# Altium project Optical Compressor.PrjPcb (part 1 of 2)
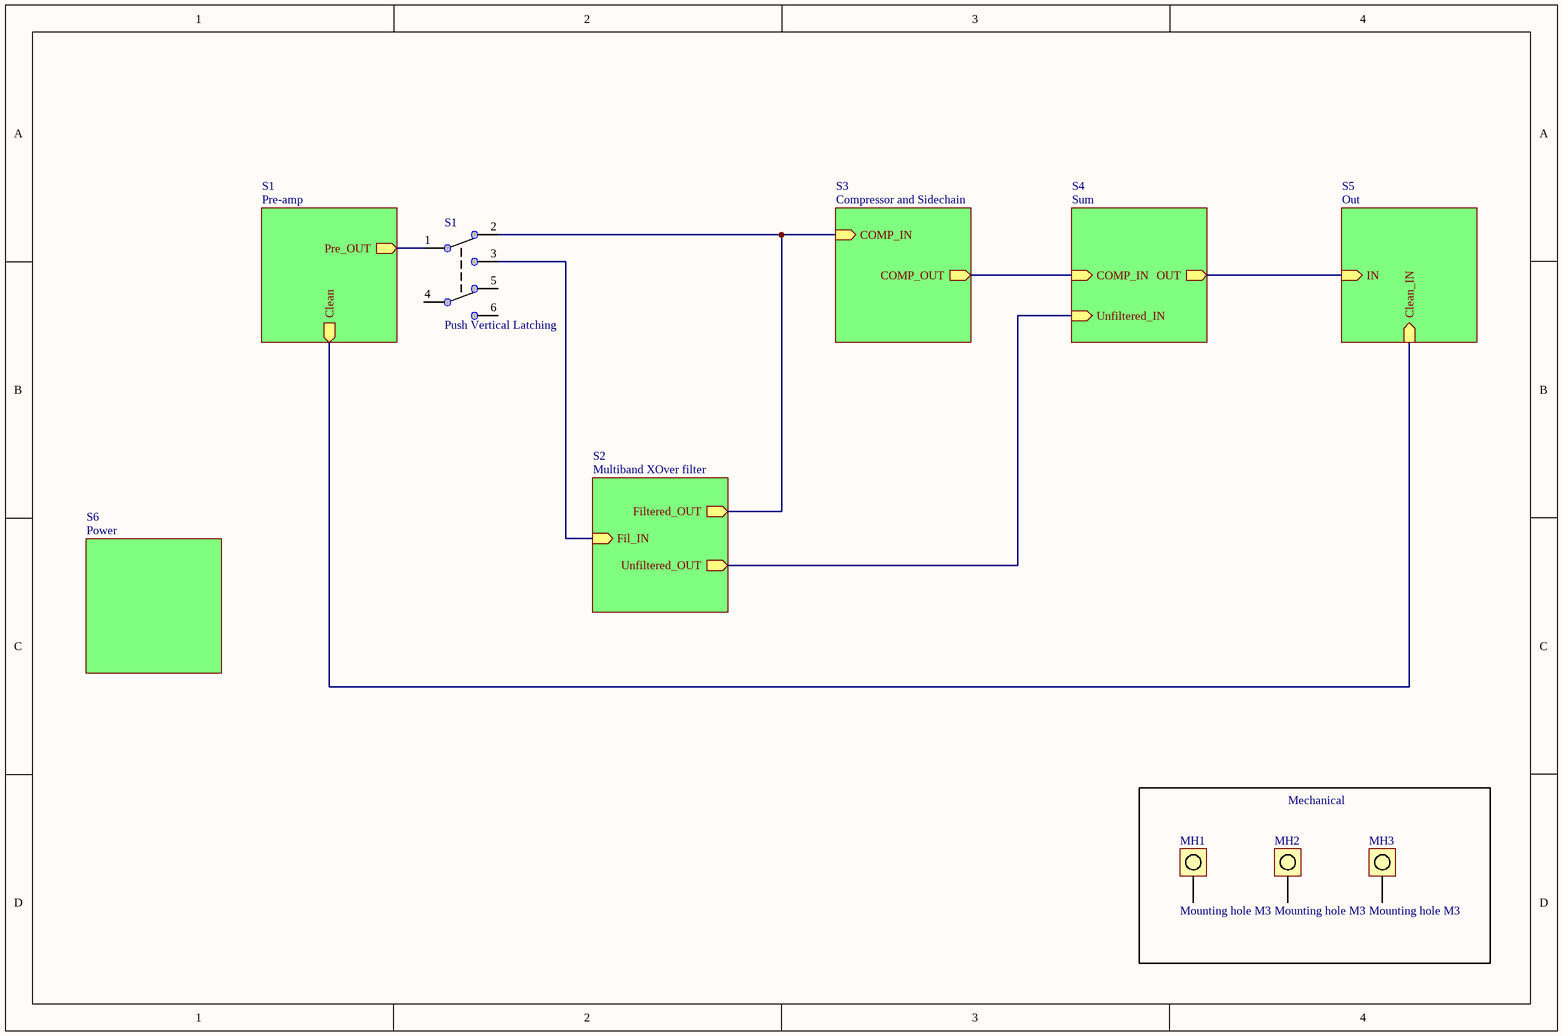
[diagram p0: Main.SchDoc]
7 sheets, 118 parts. Net scope: hierarchical (ports join the sheet entries above them; power ports are global).
Board file: Optical Compresor_V1.PcbDoc
Sheets:
  Main.SchDoc
    S1 = Pre-amp.SchDoc
    S3 = Compressor and Sidechain.SchDoc
    S5 = Out.SchDoc
    S6 = Power.SchDoc
    S2 = Multiband XOver filter.SchDoc
    S4 = Sum.SchDoc

## Sheet Main.SchDoc
size A4; SheetNumber: 1; SheetTotal: 7; ENG_APP_DATE: --/--/--; DSN_APP_DATE: --/--/--; CHK_APP_DATE: --/--/--

### Parts
MH1  Mounting hole M3  [Mounting hole M3]  (no BOM)
MH2  Mounting hole M3  [Mounting hole M3]  (no BOM)
MH3  Mounting hole M3  [Mounting hole M3]  (no BOM)
S1  Push Vertical Latching  [PUSH VERTICAL DPDT]

### Blocks framed on the sheet
Mechanical: MH1-MH3

### Sub-sheets
S1 = Pre-amp: Pre_OUT (out), Clean (out)
S2 = Multiband XOver filter: Fil_IN (in), Filtered_OUT (out), Unfiltered_OUT (out)
S3 = Compressor and Sidechain: COMP_IN (in), COMP_OUT (out)
S4 = Sum: Unfiltered_IN (in), COMP_IN (in), OUT (out)
S5 = Out: IN (in), Clean_IN (in)
S6 = Power: no entries

### Nets
NetC3_2: S1.1 ; sheet S1/Pre_OUT
NetC11_2: sheet S3/COMP_OUT, sheet S4/COMP_IN
NetC32_1: sheet S2/Unfiltered_OUT, sheet S4/Unfiltered_IN
NetR17_1: S1.3 ; sheet S2/Fil_IN
NetR24_2: sheet S5/IN, sheet S4/OUT
NetS1_2: S1.2 ; sheet S3/COMP_IN, sheet S2/Filtered_OUT
NetS2_1: sheet S1/Clean, sheet S5/Clean_IN

Not connected (* = marked no-connect by the designer): MH1 1; MH2 1; MH3 1; S1 4 5 6

### Notes on the sheet
- Document:
- Size:
- Modified date:
- A4
- Number:
- Revision:
- Sheet
- of
- Project:

### Library data of the parts
MH1-MH3 = CMP-021-0014-4: 3.2 mm mounting hole for M3 screw; Design Item ID: Mounting hole M3; Source: jimi.SchLib
S1 = CMP-028-0063-7: DPDT Pushbutton Latching; Manufacturer Part Number: TL2201EEXA; Darkglass part: D00-0005; Manufacturer: E-Switch; Electrical Life: 10000Cycles; Voltage Rating (DC): 30V; Supplied by Darkglass: YES; Actuator Length: 3mm; Operating Force: 2.16N; Current Rating: 100mA; Switch Function: On-On; ComponentLink2URL: https://datasheet.ciiva.com/16156/p010350f-16156301.pdf?src-supplier=Onlinecomponents.com; Termination: PC Pin; Design Item ID: Push Vertical; Source: main.SchLib; Max Voltage Rating (DC): 30V; RoHS: Yes; Orientation: Straight; Stock 1: 351; ComponentLink1URL: https://datasheet.ciiva.com/2879/p010350g-2879559.pdf?src-supplier=Digi-Key; Throw Configuration: DPDT; Lead Free: Lead Free; ComponentLink1Description: https://datasheet.ciiva.com/2879/p010350g-2879559.pdf?src-supplier=Digi-Key; Package Quantity: 700; ComponentLink2Description: https://datasheet.ciiva.com/16156/p010350f-16156301.pdf?src-supplier=Onlinecomponents.com; Contact Material: Silver; Selective Soldering: YES; Packaging: Bulk; Mount: Through Hole; Pricing 1: 1=0,70000, 10=0,66300, 25=0,63400, 50=0,60400, 100=0,58900, 250=0,57400, 500=0,54500, 1000=0,51500, 2500=0,49200, 10000=0,49200 (USD)

## Sheet Pre-amp.SchDoc
size A4; SheetNumber: 2; SheetTotal: 7; ENG_APP_DATE: --/--/--; DSN_APP_DATE: --/--/--; CHK_APP_DATE: --/--/--
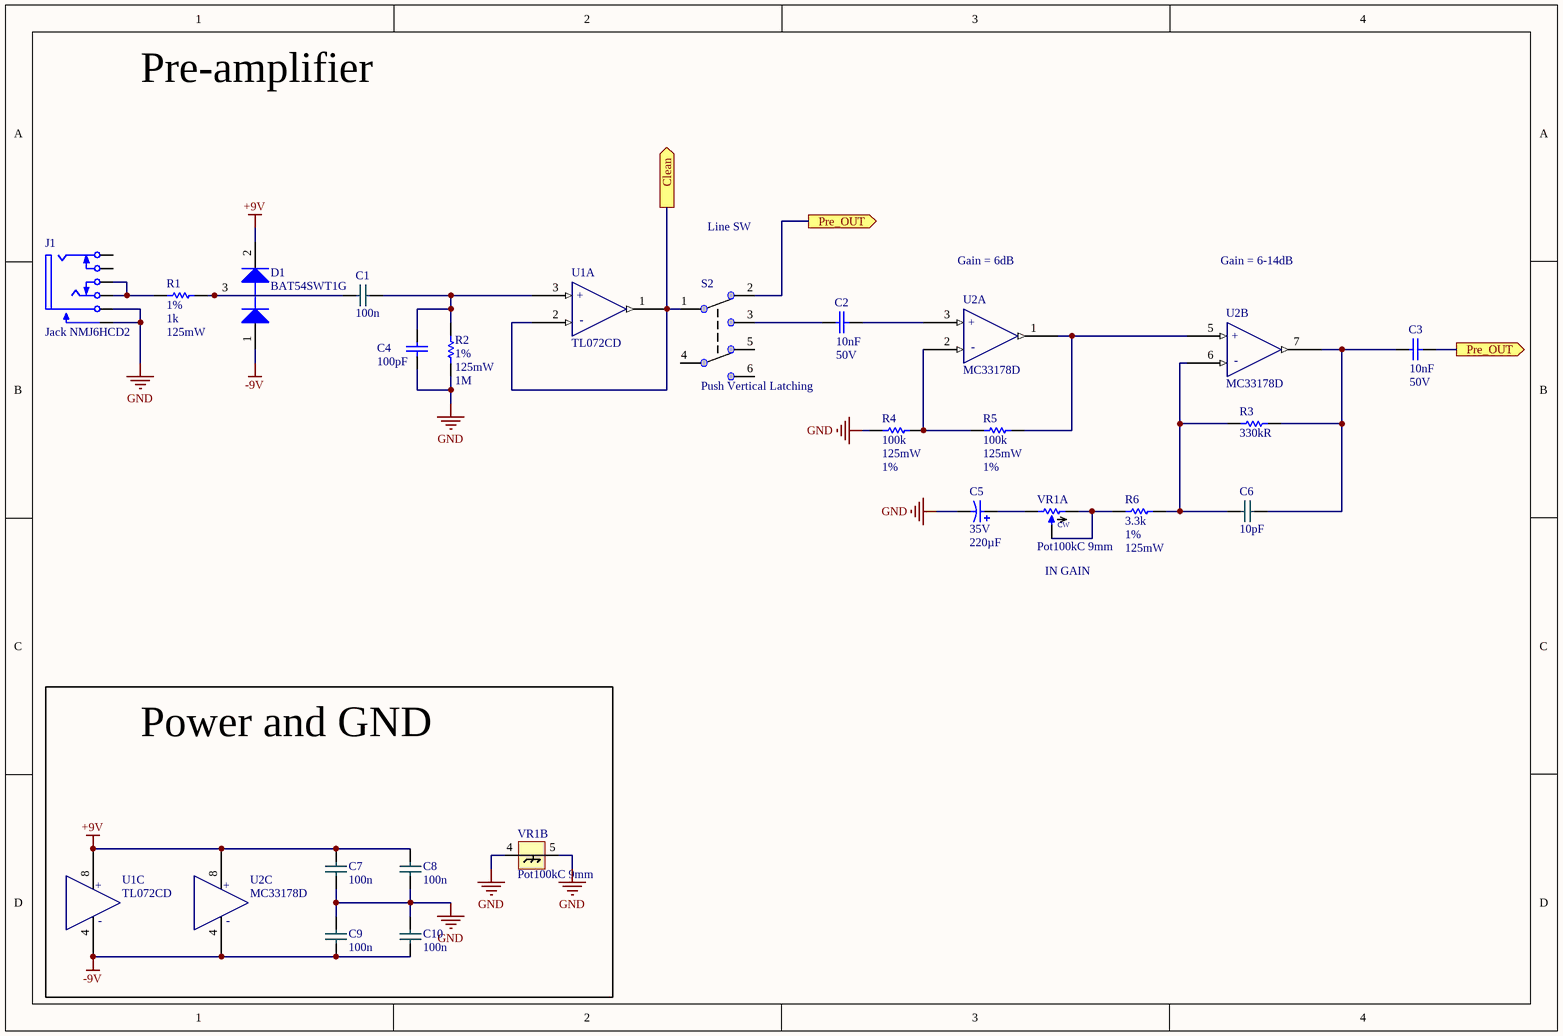
[diagram p1: Pre-amp.SchDoc]

### Parts
C1  value 100n  [0805-CAP]  (hidden comment: Cap 0805 100nF 4)
C2  Capacitance: 10nF  Rated Voltage: 50V  [0805-CAP]  (hidden comment: Cap 10nF 0805 C0G)
C3  Capacitance: 10nF  Rated Voltage: 50V  [0805-CAP]  (hidden comment: Cap 10nF 0805 C0G)
C4  Capacitance: 100pF  [0603-CAP]  (hidden comment: Cap 100pF 0603 C0G)
C5  Rated Voltage: 35V  Capacitance: 220µF  [E-CAP, SMT, diameter 10mm, height 10.2mm]  (hidden comment: Cap pol 220µF 35V)
C6  Capacitance: 10pF  [0805-CAP]  (hidden comment: cap 0805 10pF)
C7  value 100n  [0805-CAP]  (hidden comment: Cap 0805 100nF 4)
C8  value 100n  [0805-CAP]  (hidden comment: Cap 0805 100nF 4)
C9  value 100n  [0805-CAP]  (hidden comment: Cap 0805 100nF 4)
C10  value 100n  [0805-CAP]  (hidden comment: Cap 0805 100nF 4)
D1  BAT54SWT1G  [ONSC-SOT-323-3-419-04_V]
J1  Jack NMJ6HCD2  [Neutrik Jack metal nut]
R1  Tolerance (+-): 1%  Resistance: 1k  Power: 125mW  [0805-RES]  (hidden comment: Res 1k 1% 0805)
R2  Tolerance (+-): 1%  Power: 125mW  Resistance: 1M  [0805-RES]  (hidden comment: Res 1M 1% 0805)
R3  Resistance: 330kR  [0805-RES]  (hidden comment: Res 0805 330k 1%)
R4  Resistance: 100k  Power: 125mW  Tolerance (+-): 1%  [0805-RES]  (hidden comment: Res 100k 1% 0805)
R5  Resistance: 100k  Power: 125mW  Tolerance (+-): 1%  [0805-RES]  (hidden comment: Res 100k 1% 0805)
R6  Resistance: 3.3k  Tolerance (+-): 1%  Power: 125mW  [0805-RES]  (hidden comment: Res 3.3k 1% 0805)
S2  Push Vertical Latching  [PUSH VERTICAL DPDT]
U1  TL072CD  [SOIC8-127P600X175-8N]  (parts A,C of 3)
U2  MC33178D  [SOIC8-127P600X175-8N]  (parts A,B,C of 3)
VR1  Pot100kC 9mm  [LJV 9mm pot]  (parts A,B of 2)

### Blocks framed on the sheet
Power and GND: C7-C10 U1 U2 VR1

### Ports
Clean (out), Pre_OUT (out)

### Nets
+9V: C7.2 C8.2 D1.2(K) U1.8(V+) U2.8
-9V: C9.1 C10.1 D1.1(A) U1.4(V-) U2.4
GND: C4.2 C5.2 C7.1 C8.1 C9.2 C10.2 J1.1 J1.6 R2.2 R4.1 VR1.4 VR1.5
NetC1_1: C1.1 D1.3(K/A) R1.2
NetC1_2: C1.2 C4.1 R2.1 U1.3(IN+)
NetC2_1: C2.1 S2.3
NetC2_2: C2.2 U2.3
NetC3_1: C3.1 C6.2 R3.2 U2.7
NetC3_2: C3.2 S2.2 ; port Pre_OUT
NetC5_1: C5.1 VR1.1(CCWPIN)
NetC6_1: C6.1 R3.1 R6.2 U2.6
NetJ1_3: J1.3 J1.4 R1.1
NetR4_2: R4.2 R5.1 U2.2
NetR5_2: R5.2 U2.1 U2.5
NetR6_1: R6.1 VR1.2(WIPER) VR1.3(CWPIN)
NetS2_1: S2.1 U1.1(OUT) U1.2(IN-) ; port Clean

Not connected (* = marked no-connect by the designer): J1 2 5; S2 4 5 6

### Notes on the sheet
- Pre-amplifier
- Line SW
- Gain = 6dB
- Gain = 6-14dB
- (near VR1) IN GAIN
- Document:
- Size:
- Modified date:
- A4
- Number:
- Revision:
- Sheet
- of
- Project:
- (in symbol CMP-028-0012-7, part A) +; -
- (in symbol CMP-028-0012-7, part C) +; -
- (in symbol CMP-028-0053-5, part A) CW
- (in symbol CMP-032-0003-7, part A) +; -
- (in symbol CMP-032-0003-7, part B) +; -
- (in symbol CMP-032-0003-7, part C) +; -

### Library data of the parts
C1 C7-C10 = CMP-019-0144-11: 0.1uF 25volts C0G 5%; Source: main.SchLib; PackageDescription: Chip Capacitor; LatestRevisionNote: IPC-7351 Footprint Added.; LatestRevisionDate: 29-May-2009; Publisher: Altium Limited; Published: 8-Jun-2000; Mouser part: 81-GRM31C5C1E104JA01; Design Item ID: Cap 0805 100nF 4; PackageReference: C1206; Fitted: Fitted
C2 C3 = CMP-04096-2: Cap 10nF 0805 C0G 50V +-5%; Tolerance (+-): 5%; Dielectric: C0G; Maximum operating temperature: 125°C; Height: 950µm; Size (Imperial): 0805
C4 = CMP-04086-2: Cap 100pF 0603 C0G 50V +-5%; Tolerance (+-): 5%; Rated Voltage: 50V; Maximum operating temperature: 125°C; Height: 900µm; Size (Imperial): 0603; Dielectric: C0G
C5 = CMP-00120-4: Cap Aluminum 220uF 35V ±20% (10x10.2mm) SMD 2000h 85°C; Maximum operating temperature: 85°C; Lifetime @ Max. Temp. (hours): 2000h; + Tolerance: 20%; - Tolerance: 20%
C6 = CMP-019-0194-1: Ceramic Capacitor, Multilayer, Ceramic, 25V, 5% +Tol, 5% -Tol, C0G, -/+30ppm/Cel TC, 0.00001uF, Surface Mount, 0805; Manufacturer Series: VJ; Multilayer: Yes; JESD-609 Code: e3; Size Code: 0805; Terminal Finish: Tin; Termination: Wraparound; Negative Tolerance: 5%; Max Operating Temperature: 125°C; RoHS Compliant: Yes; REACH SVHC: Yes; Capacitor Type: Ceramic; Positive Tolerance: 5%; Mount: Surface Mount; Packaging: Tape and Reel; Package Shape: Rectangular; Dielectric Material: Ceramic; Temperature Characteristics Code: C0G; Rated DC Voltage (URdc): 25V; Min Operating Temperature: -55°C; Number of Pins: 2
D1 = CMP-055-0001-A.2: Rectifier Diode, Schottky, 2 Element, 0.2A, 30V V(RRM), Silicon; Forward Voltage: 800mV; Element Configuration: Dual; Peak Reverse Current: 2uA; Average Rectified Current: 200mA; Recovery Time: 5ns; Max Forward Surge Current (Ifsm): 600mA; Power Dissipation: 200mW; Mount: Surface Mount; REACH SVHC: No SVHC; Max Reverse Voltage (DC): 30V; Height: 0.9mm; Forward Current: 200mA; Max Repetitive Reverse Voltage (Vrrm): 30V; Lead Free: Lead Free; Max Operating Temperature: 125°C; Max Reverse Leakage Current: 2uA; Min Operating Temperature: -65°C; Number of Pins: 3; Reverse Recovery Time: 5ns; Radiation Hardening: No; Length: 2.2mm; Weight: 0.03g; Case/Package: SOT-323; Width: 1.35mm; Peak Non-Repetitive Surge Current: 600mA; Package Quantity: 1; Max Surge Current: 600mA; Packaging: Tape and Reel; Contact Plating: Tin,Matte
J1 = CMP-028-0060-3: Jack 1/4 stereo switched - PCBH - chrome nut; Manufacturer: Neutrik; Darkglass part: D00-0011; Max Current Rating: 3A; Supplied by Darkglass: YES; Voltage Rating: 50V; Number of Contacts: 2; Number of Ports: 1; Gender: Female; Orientation: Straight; Depth: 18.2mm; ComponentLink3Description: http://datasheet.octopart.com/NMJ6HCD2-Neutrik-datasheet-66533984.pdf?src-supplier=Newark; Package Quantity: 200; ComponentLink1Description: https://datasheet.ciiva.com/16148/210-217181-16148163.pdf?src-supplier=Onlinecomponents.com; Color: Black; Max Operating Temperature: 70°C; Termination: Solder; Design Item ID: Jack NMJ6HCD2; Source: main.SchLib; Mount: Through Hole; Contact Material: Chrome; Number of Terminals: 6; ComponentLink1URL: https://datasheet.ciiva.com/16148/210-217181-16148163.pdf?src-supplier=Onlinecomponents.com; Manufacturer Part Number: NMJ6HCD2; Pricing 1: 1 = 1.74000, 10 = 1.57000, 50 = 1.37000, 100 = 1.32000, 1000 = 1.24000, 10000 = 1.24000 (USD); Weight: 0.282192oz; Selective Soldering: YES; Stock 1: 16927; ComponentLink3URL: http://datasheet.octopart.com/NMJ6HCD2-Neutrik-datasheet-66533984.pdf?src-supplier=Newark; ComponentLink2Description: http://datasheet.octopart.com/NMJ6HCD2-Neutrik-datasheet-46041.pdf?src-supplier=Allied+Electronics; Housing Material: Polyamide; Contact Plating: Silver; Min Operating Temperature: -25°C; ComponentLink2URL: http://datasheet.octopart.com/NMJ6HCD2-Neutrik-datasheet-46041.pdf?src-supplier=Allied+Electronics
R1 = CMP-02472-2: Resistor 1k +-1% 0805 Thin film 0.125W +-50ppm/°C; Temperature Coefficient (ppm/°C): 50; Maximum working voltage: 150V; Composition: Thin film; Size (Imperial): 0805
R2 = CMP-02809-2: Resistor 1M +-1% 0805 Thin film 0.125W +-50ppm/°C; Maximum working voltage: 150V; Temperature Coefficient (ppm/°C): 50; Composition: Thin film; Size (Imperial): 0805
R3 = CMP-037-0126-8: 330kohm, 125mW, 1%, thin film; Temperature Coefficient: 50ppm/°C; Voltage Rating (DC): 150V; Composition: Thin Film; Case/Package: 0805; Case Code (Imperial): 0805; Case Code (Metric): 2012; ComponentLink1Description: https://datasheet.ciiva.com/5990/1392914-5990598.pdf?src-supplier=Farnell; ComponentLink1URL: https://datasheet.ciiva.com/5990/1392914-5990598.pdf?src-supplier=Farnell; ComponentLink2Description: https://datasheet.ciiva.com/5990/1392914-5990601.pdf?src-supplier=Farnell; ComponentLink2URL: https://datasheet.ciiva.com/5990/1392914-5990601.pdf?src-supplier=Farnell; ComponentLink3Description: https://datasheet.ciiva.com/2561/pyu-rt-1-to-0-05-rohs-l-5-2561162.pdf?src-supplier=Digi-Key; ComponentLink3URL: https://datasheet.ciiva.com/2561/pyu-rt-1-to-0-05-rohs-l-5-2561162.pdf?src-supplier=Digi-Key; Contact Plating: Tin; Depth: 1.25mm; Design Item ID: Res 0805 330k 1%; Height: 0.024inch; LatestRevisionDate: 17-Jul-2002; LatestRevisionNote: Re-released for DXP Platform.; Lead Free: Lead Free; Length: 0.079inch; Max Operating Temperature: 125°C; Max Power Dissipation: 125mW; Military Standard: Not; Min Operating Temperature: -55°C; Number of Pins: 2; Number of Terminations: 2; PackageDescription: Axial Device, Thru-Hole; 2 Leads; 0.5 in Pin Spacing; Package Quantity: 5000; PackageReference: AXIAL-0.5; Packaging: Tape and Reel; Power Rating: 125mW; Pricing 1: 1 = 0,10000, 10 = 0,09300, 100 = 0,03580, 1000 = 0,01573, 2500 = 0,01358 (USD); Published: 8-Jun-2000; Publisher: Altium Limited; Radiation Hardening: No; REACH SVHC: No SVHC; RoHS: Yes; Source: main.SchLib; Stock 1: 1168; Termination: SMD/SMT; Tolerance: 1%; Value: 330k; Voltage Rating: 150V; Width: 0.049inch
R4 R5 = CMP-02701-2: Resistor 100k +-1% 0805 Thin film 0.125W +-50ppm/°C; Temperature Coefficient (ppm/°C): 50; Maximum working voltage: 150V; Composition: Thin film; Size (Imperial): 0805
R6 = CMP-02529-2: Resistor 3.3k +-1% 0805 Thin film 0.125W +-50ppm/°C; Maximum working voltage: 150V; Temperature Coefficient (ppm/°C): 50; Composition: Thin film; Size (Imperial): 0805
S2 = CMP-028-0063-7: as S1 on sheet Main; ComponentLink2URL: https://datasheet.ciiva.com/16156/p010350f-16156301.pdf?src-supplier=Onlinecomponents.com; Termination: PC Pin; Design Item ID: Push Vertical; Source: main.SchLib; Max Voltage Rating (DC): 30V; RoHS: Yes; Orientation: Straight; Stock 1: 351; ComponentLink1URL: https://datasheet.ciiva.com/2879/p010350g-2879559.pdf?src-supplier=Digi-Key; Throw Configuration: DPDT; Lead Free: Lead Free; ComponentLink1Description: https://datasheet.ciiva.com/2879/p010350g-2879559.pdf?src-supplier=Digi-Key; Package Quantity: 700; ComponentLink2Description: https://datasheet.ciiva.com/16156/p010350f-16156301.pdf?src-supplier=Onlinecomponents.com; Contact Material: Silver; Selective Soldering: YES; Packaging: Bulk; Mount: Through Hole; Pricing 1: 1=0,70000, 10=0,66300, 25=0,63400, 50=0,60400, 100=0,58900, 250=0,57400, 500=0,54500, 1000=0,51500, 2500=0,49200, 10000=0,49200 (USD)
U1 = CMP-028-0012-7: Operational Amplifiers - Op Amps Dual Low Noise JFET SOIC8; Manufacturer 1: Texas Instruments; Operating Supply Voltage: 18V; Number of Elements: 2; Bandwidth: 3MHz; Dual Supply Voltage: 9V; Input Bias Current: 200pA; Min Dual Supply Voltage: 3.5V; Voltage Gain: 106.02dB; Max I/O Voltage: 10mV; Common Mode Rejection Ratio: 70dB; Input Offset Voltage (Vos): 3mV; Slew Rate: 13V/µs; Operating Supply Current: 1.4mA; Nominal Supply Current: 5mA; ComponentLink4URL: http://www.farnell.com/datasheets/1862384.pdf?src-supplier=Element14; ComponentLink4Description: http://www.farnell.com/datasheets/1862384.pdf?src-supplier=Element14; Manufacturer Part Number 1: TL072CD; REACH SVHC: No SVHC; Pricing 1: 1 = 0.71000, 10 = 0.59500, 50 = 0.59500, 100 = 0.38400, 1000 = 0.30700, 10000 = 0.25000 (USD); RoHS: Yes; Source: main.SchLib; ComponentLink1URL: http://www.ti.com/general/docs/lit/getliterature.tsp?genericPartNumber=TL072&&fileType=pdf&src-supplier=Avnet; Height: 1.58mm; Gain Bandwidth Product: 3MHz; ComponentLink5URL: http://focus.ti.com/lit/ds/symlink/tl074.pdf?src-supplier=Avnet+Asia; Number of Amplifiers: 2; ComponentLink2Description: https://www.distrelec.biz/Web/Downloads/_t/ds/tl07x-series_eng_tds.pdf?mime=application%2Fpdf&src-supplier=Distrelec; Radiation Hardening: No; ComponentLink3URL: http://www.ti.com/lit/ds/symlink/tl071a.pdf?src-supplier=Digi-Key; Unity Gain Bandwidth Product: 3MHz; Case/Package: D; Max Operating Temperature: 85°C; Packaging: Rail/Tube; Number of Circuits: 2; Number of Pins: 8; Length: 4.9mm; Number of Channels: 2; Package Quantity: 75; Min Operating Temperature: -40°C; Width: 3.91mm; Lead Free: Lead Free; Stock 1: 14514; ComponentLink3Description: http://www.ti.com/lit/ds/symlink/tl071a.pdf?src-supplier=Digi-Key; Nominal Gain Bandwidth Product: 3MHz; ComponentLink5Description: http://focus.ti.com/lit/ds/symlink/tl074.pdf?src-supplier=Avnet+Asia; Max Dual Supply Voltage: 18V; ComponentLink1Description: http://www.ti.com/general/docs/lit/getliterature.tsp?genericPartNumber=TL072&&fileType=pdf&src-supplier=Avnet; ComponentLink2URL: https://www.distrelec.biz/Web/Downloads/_t/ds/tl07x-series_eng_tds.pdf?mime=application%2Fpdf&src-supplier=Distrelec; Design Item ID: TL072CD
U2 = CMP-032-0003-7: IC OPAMP GP 5MHZ 8SOIC; Manufacturer: ON Semiconductor; Manufacturer Part Number: MC33178DR2G; Slew Rate: 2V/µs; Max Supply Voltage: 18V; Input Bias Current: 500nA; Number of Elements: 2; Output Current: 80mA; Nominal Supply Current: 900uA; Operating Supply Current: 1.7mA; Min Dual Supply Voltage: 2V; Common Mode Rejection Ratio: 80dB; Max Frequency: 100kHz; Input Offset Voltage (Vos): 3mV; Voltage Gain: 106.02dB; Output Current per Channel: 100mA; ComponentLink3Description: https://datasheet.ciiva.com/1796/mc33178-d-1796436.pdf?src-supplier=Digi-Key; Contact Plating: Tin; Packaging: Tape and Reel; ComponentLink4URL: https://datasheet.ciiva.com/8078/89824-8078566.pdf?src-supplier=Element14; ComponentLink1Description: https://datasheet.ciiva.com/30481/0900766b811a6563-30481352.pdf?src-supplier=RSComponents; Number of Pins: 8; Width: 0.157inch; ComponentLink6URL: https://datasheet.ciiva.com/2973/mc33178-d-2973665.pdf?src-supplier=Avnet; Nominal Gain Bandwidth Product: 5MHz; Min Operating Temperature: -40°C; Design Item ID: MC33178D; Lead Free: Lead Free; Max Dual Supply Voltage: 18V; ComponentLink9Description: https://datasheet.ciiva.com/26056/mc33178-d-26056808.pdf?src-supplier=Avnet+Europe; ComponentLink8URL: https://datasheet.ciiva.com/17068/70275428-17068423.pdf?src-supplier=Allied+Electronics; Length: 0.196inch; Gain Bandwidth Product: 5MHz; ComponentLink9URL: https://datasheet.ciiva.com/26056/mc33178-d-26056808.pdf?src-supplier=Avnet+Europe; Stock 1: 25846; Number of Channels: 2; Number of Amplifiers: 2; ComponentLink6Description: https://datasheet.ciiva.com/2973/mc33178-d-2973665.pdf?src-supplier=Avnet; ComponentLink5URL: https://datasheet.ciiva.com/48491/mc33178-d-48491755.pdf?src-supplier=Avnet; Mouser part: 863-MC33178DG; Case/Package: SOIC; Height: 0.059inch; ComponentLink5Description: https://datasheet.ciiva.com/48491/mc33178-d-48491755.pdf?src-supplier=Avnet; ComponentLink2URL: https://datasheet.ciiva.com/1796/mc33178-d-1796435.pdf?src-supplier=Digi-Key; Radiation Hardening: No; ComponentLink2Description: https://datasheet.ciiva.com/1796/mc33178-d-1796435.pdf?src-supplier=Digi-Key; ComponentLink8Description: https://datasheet.ciiva.com/17068/70275428-17068423.pdf?src-supplier=Allied+Electronics; Package Quantity: 1; ComponentLink1URL: https://datasheet.ciiva.com/30481/0900766b811a6563-30481352.pdf?src-supplier=RSComponents; Halogen Free: Halogen Free; Unity Gain Bandwidth Product: 5MHz; ComponentLink3URL: https://datasheet.ciiva.com/1796/mc33178-d-1796436.pdf?src-supplier=Digi-Key; ComponentLink4Description: https://datasheet.ciiva.com/8078/89824-8078566.pdf?src-supplier=Element14; Max Operating Temperature: 85°C; REACH SVHC: No SVHC; ComponentLink7Description: https://datasheet.ciiva.com/1796/mc33178-d-1796437.pdf?src-supplier=Digi-Key; Pricing 1: 1 = 0.86000, 10 = 0.75300, 100 = 0.57700, 500 = 0.45614, 1000 = 0.36492 (USD); ComponentLink7URL: https://datasheet.ciiva.com/1796/mc33178-d-1796437.pdf?src-supplier=Digi-Key; RoHS: Yes; Source: main.SchLib; Bandwidth: 5MHz; Number of Circuits: 2; Power Supply Rejection Ratio (PSRR): 80dB; PartId: 1
VR1 = CMP-028-0053-5: LJV 9mm pot; Darkglass part: D00-0002; Manufacturer Part Number 1: RP09110NOBA-H02-1485 (C104,KA15A6.5); Value: 100kC; Selective Soldering: YES; SET POSITION: 1; Source: main.SchLib; Design Item ID: Pot100kC 9mm; Supplied by Darkglass: YES

## Sheet Compressor and Sidechain.SchDoc
size A4; SheetNumber: 3; SheetTotal: 7
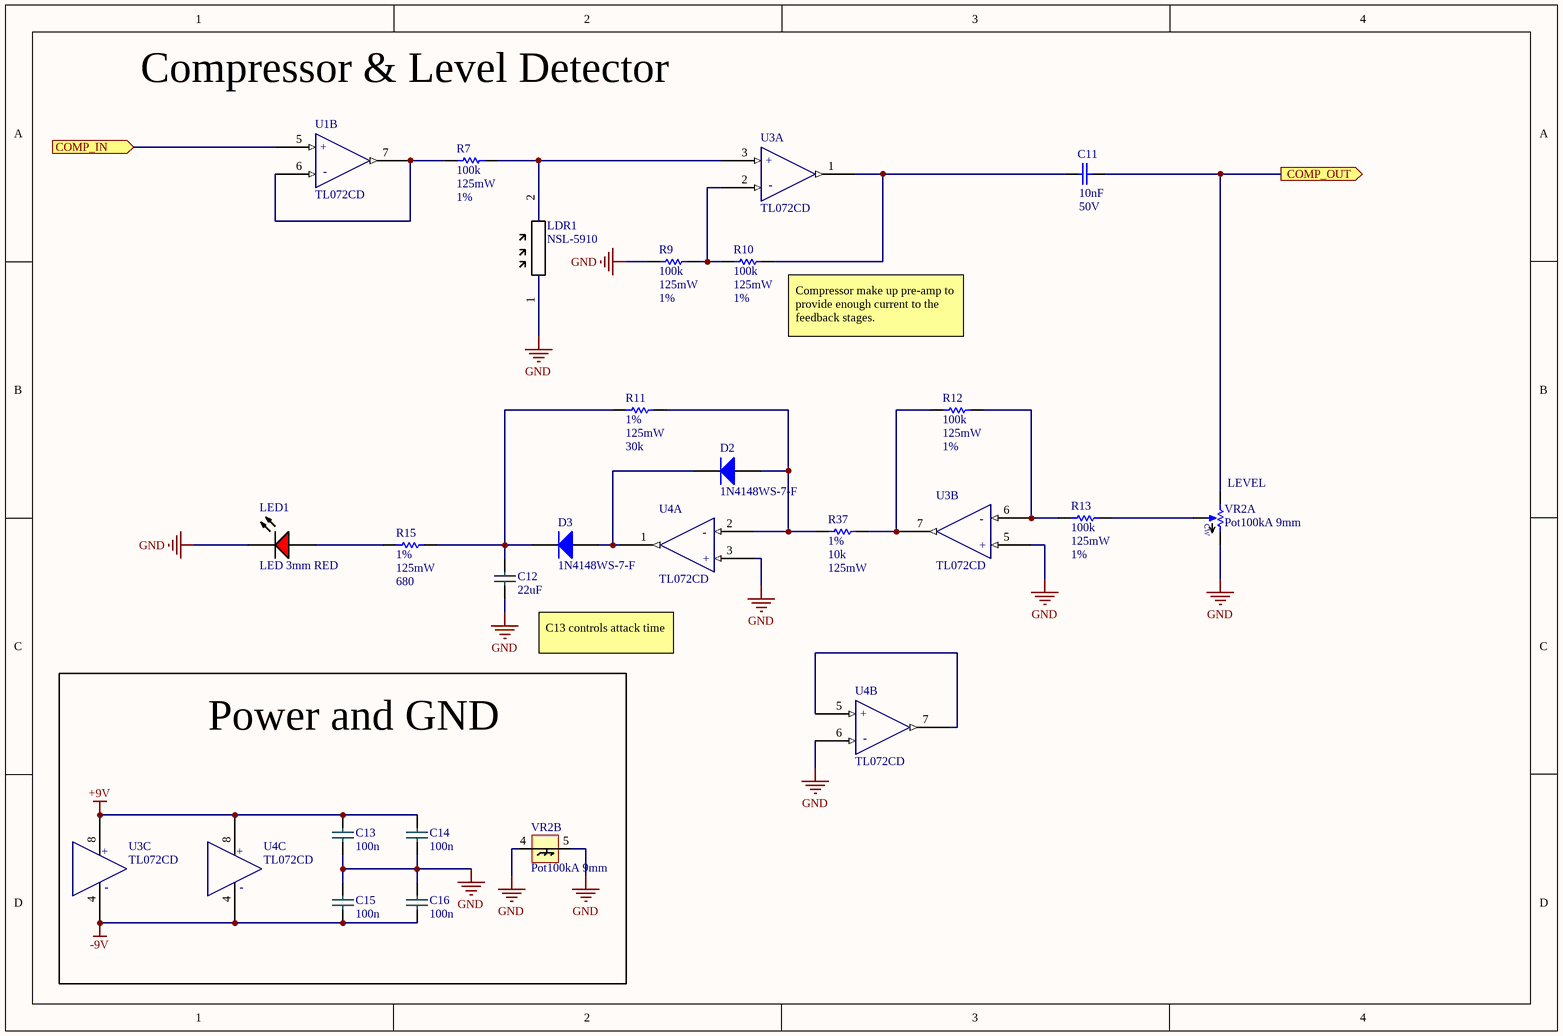
[diagram p2: Compressor and Sidechain.SchDoc]

### Parts
C11  Capacitance: 10nF  Rated Voltage: 50V  [0805-CAP]  (hidden comment: Cap 10nF 0805 C0G)
C12  value 22uF  [1206-CAP]  (hidden comment: Cap 1206 22uF)
C13  value 100n  [0805-CAP]  (hidden comment: Cap 0805 100nF 4)
C14  value 100n  [0805-CAP]  (hidden comment: Cap 0805 100nF 4)
C15  value 100n  [0805-CAP]  (hidden comment: Cap 0805 100nF 4)
C16  value 100n  [0805-CAP]  (hidden comment: Cap 0805 100nF 4)
D2  1N4148WS-7-F  [1N4148WS-7-F]
D3  1N4148WS-7-F  [1N4148WS-7-F]
LDR1  NSL-5910  [FB_28C0236-0JW-10]
LED1  LED 3mm RED  [KING-WP710A10QBCD_V]
R7  Resistance: 100k  Power: 125mW  Tolerance (+-): 1%  [0805-RES]  (hidden comment: Res 100k 1% 0805)
R9  Resistance: 100k  Power: 125mW  Tolerance (+-): 1%  [0805-RES]  (hidden comment: Res 100k 1% 0805)
R10  Resistance: 100k  Power: 125mW  Tolerance (+-): 1%  [0805-RES]  (hidden comment: Res 100k 1% 0805)
R11  Tolerance (+-): 1%  Power: 125mW  Resistance: 30k  [0805-RES]  (hidden comment: Res 30k 1% 0805)
R12  Resistance: 100k  Power: 125mW  Tolerance (+-): 1%  [0805-RES]  (hidden comment: Res 100k 1% 0805)
R13  Resistance: 100k  Power: 125mW  Tolerance (+-): 1%  [0805-RES]  (hidden comment: Res 100k 1% 0805)
R15  Tolerance (+-): 1%  Power: 125mW  Resistance: 680  [0805-RES]  (hidden comment: Res 680R 1% 0805)
R37  Tolerance (+-): 1%  Resistance: 10k  Power: 125mW  [0805-RES]  (hidden comment: Res 10k 1% 0805)
U1  TL072CD  [SOIC8-127P600X175-8N]  (part B of 3)
U3  TL072CD  [SOIC8-127P600X175-8N]  (parts A,B,C of 3)
U4  TL072CD  [SOIC8-127P600X175-8N]  (parts A,B,C of 3)
VR2  Pot100kA 9mm  [LJV 9mm pot]  (parts A,B of 2)

### Blocks framed on the sheet
Power and GND: C13-C16 U3 U4 VR2

### Ports
COMP_IN (in), COMP_OUT (out)

### Nets
+9V: C13.2 C14.2 U3.8(V+) U4.8(V+)
-9V: C15.1 C16.1 U3.4(V-) U4.4(V-)
GND: C12.1 C13.1 C14.1 C15.2 C16.2 LDR1.1 LED1.2(K) R9.2 U3.5(IN+) U4.3(IN+) U4.6(IN-) VR2.3(CWPIN) VR2.4 VR2.5
NetC11_1: C11.1 R10.1 U3.1(OUT)
NetC11_2: C11.2 VR2.1(CCWPIN) ; port COMP_OUT
NetC12_2: C12.2 D3.2(K) R11.1 R15.2
NetD2_1: D2.1(A) R11.2 R37.1 U4.2(IN-)
NetD2_2: D2.2(K) D3.1(A) U4.1(OUT)
NetLDR1_2: LDR1.2 R7.1 U3.3(IN+)
NetLED1_1: LED1.1(A) R15.1
NetR7_2: R7.2 U1.6(IN-) U1.7
NetR9_1: R9.1 R10.2 U3.2(IN-)
NetR12_1: R12.1 R13.2 U3.6(IN-)
NetR12_2: R12.2 R37.2 U3.7
NetR13_1: R13.1 VR2.2(WIPER)
NetS1_2: U1.5(IN+) ; port COMP_IN
NetU4_5: U4.5(IN+) U4.7

### Notes on the sheet
- Compressor & Level Detector
- (near R10) Compressor make up pre-amp to provide enough current to the feedback stages.
- (near VR2) LEVEL
- C13 controls attack time
- (in symbol CMP-028-0012-7, part A) +; -
- (in symbol CMP-028-0012-7, part B) +; -
- (in symbol CMP-028-0012-7, part C) +; -
- (in symbol CMP-028-0051-3, part A) CW

### Library data of the parts
C11 = CMP-04096-2: as C2 on sheet Pre-amp; Dielectric: C0G; Maximum operating temperature: 125°C; Height: 950µm; Size (Imperial): 0805
C12 = CMP-019-0043-11: 22uF, 25V, X5R, 20%; Source: main.SchLib; Mount: Surface Mount; Tolerance: 20%; Case/Package: 1206; Min Operating Temperature: -55°C; Voltage Rating: 25V; Length: 0.126inch; Voltage Rating (DC): 25V; Thickness: 0.02inch; Dielectric: X5R; Stock 1: 409; Packaging: Tape and Reel; Capacitance: 22uF; Case Code (Metric): 3216; RoHS: Yes; Width: 0.063inch; Max Operating Temperature: 85°C; Case Code (Imperial): 1206; Pricing 1: 1 = 0.72000, 10 = 0.51900, 50 = 0.51900, 100 = 0.34200, 1000 = 0.21500, 10000 = 0.15900 (USD); Design Item ID: Cap 1206 22uF
C13-C16 = CMP-019-0144-11: 0.1uF 25volts C0G 5%; Source: main.SchLib; PackageDescription: Chip Capacitor; LatestRevisionNote: IPC-7351 Footprint Added.; LatestRevisionDate: 29-May-2009; Publisher: Altium Limited; Published: 8-Jun-2000; Mouser part: 81-GRM31C5C1E104JA01; Design Item ID: Cap 0805 100nF 4; PackageReference: C1206; Fitted: Fitted
D2 D3 = CMP-029-0008-5: Fast Switching Diode, 75 V, 0.3 A, -65 to 150 degC, 2-Pin SOD323, RoHS, Tape and Reel; Manufacturer: Pericom; Forward Current: 300mA; Power Rating: 200mW; Current: 2A; Forward Voltage: 1.25V; Peak Reverse Current: 1uA; Voltage Rating (DC): 75V; Recovery Time: 4ns; Current Rating: 150mA; Element Configuration: Single; Capacitance: 2pF; Polarity: Standard; Available Preview Images: 2D; Pricing 1: 1 = 0.19000, 10 = 0.17100, 100 = 0.09320, 500 = 0.05736, 1000 = 0.03911 (USD); Width: 1.4mm; Design Item ID: 1N4148WS-7-F; ComponentLink8URL: https://datasheet.ciiva.com/911/ds30097-911742.pdf?src-supplier=Digi-Key; ComponentLink19Description: http://datasheet.octopart.com/1N4148WS-7-F-Diodes-Inc.-datasheet-14053694.pdf?src-supplier=IIIC; ComponentLink20Description: http://datasheet.octopart.com/1N4148WS-7-F-Multicomp-datasheet-21397732.pdf?src-supplier=Newark; PackageDescription: 2-Pin Small Outline Diode, Body 1.7 x 1.3 mm; Packaging: Tape and Reel; ComponentLink3URL: https://datasheet.ciiva.com/16199/ds30097-16199061.pdf?src-supplier=Future+Electronics; ComponentLink20URL: http://datasheet.octopart.com/1N4148WS-7-F-Multicomp-datasheet-21397732.pdf?src-supplier=Newark; ComponentLink16URL: http://datasheet.octopart.com/1N4148WS-7-F-Diodes-Inc.-datasheet-479.pdf?src-supplier=Mouser; ComponentLink1Description: Manufacturer URL; ComponentLink10URL: https://datasheet.ciiva.com/911/ds30097-911743.pdf?src-supplier=Digi-Key; Source: main.SchLib; ComponentLink6Description: https://datasheet.ciiva.com/8300/ds30097-8300396.pdf?src-supplier=Avnet; Lead Free: Lead Free; ComponentLink5URL: https://datasheet.ciiva.com/1179/ds30097-1179355.pdf?src-supplier=Element14; ComponentLink11Description: http://datasheet.octopart.com/1N4148WS-7-F-Diodes-Inc.-datasheet-11839050.pdf?src-supplier=Newark; ComponentLink4URL: https://datasheet.ciiva.com/16472/ds30097-16472599.pdf?src-supplier=Avnet+Asia; ComponentLink13URL: http://datasheet.octopart.com/1N4148WS-7-F-Diodes-Inc.-datasheet-10031541.pdf?src-supplier=Newark; ComponentLink2Description: Datasheet; ComponentLink4Description: https://datasheet.ciiva.com/16472/ds30097-16472599.pdf?src-supplier=Avnet+Asia; PackageReference: SOD323-2; ComponentLink3Description: https://datasheet.ciiva.com/16199/ds30097-16199061.pdf?src-supplier=Future+Electronics; Mount: Surface Mount; Manufacturer Part Number: 1N4148WS-7-F; ComponentLink12Description: http://datasheet.octopart.com/1N4148WS-7-F-Diodes-Inc.-datasheet-8329243.pdf?src-supplier=Newark; ComponentLink9Description: https://datasheet.ciiva.com/25946/ds30097-25946926.pdf?src-supplier=Avnet+Europe; ComponentLink8Description: https://datasheet.ciiva.com/911/ds30097-911742.pdf?src-supplier=Digi-Key; ComponentLink15Description: http://datasheet.octopart.com/1N4148WS-7-F-Diodes-Inc.-datasheet-62305040.pdf?src-supplier=Element14; Power Dissipation: 200mW; ComponentLink13Description: http://datasheet.octopart.com/1N4148WS-7-F-Diodes-Inc.-datasheet-10031541.pdf?src-supplier=Newark; REACH SVHC: No SVHC; ComponentLink21URL: http://datasheet.octopart.com/1N4148WS-7-F-Pericom-datasheet-62305040.pdf?src-supplier=Newark; ComponentLink12URL: http://datasheet.octopart.com/1N4148WS-7-F-Diodes-Inc.-datasheet-8329243.pdf?src-supplier=Newark; Radiation Hardening: No; ComponentLink18URL: http://datasheet.octopart.com/1N4148WS-7-F-Diodes-Inc.-datasheet-7284054.pdf?src-supplier=Jameco; Height: 1mm; Max Forward Surge Current (Ifsm): 2A; ComponentLink1URL: http://www.diodes.com/; ComponentLink6URL: https://datasheet.ciiva.com/8300/ds30097-8300396.pdf?src-supplier=Avnet; ComponentLink10Description: https://datasheet.ciiva.com/911/ds30097-911743.pdf?src-supplier=Digi-Key; ComponentLink7URL: https://datasheet.ciiva.com/911/ds30097-911741.pdf?src-supplier=Digi-Key; Length: 1.8mm; Stock 1: 107341; ComponentLink18Description: http://datasheet.octopart.com/1N4148WS-7-F-Diodes-Inc.-datasheet-7284054.pdf?src-supplier=Jameco; ComponentLink17Description: http://datasheet.octopart.com/1N4148WS-7-F-Diodes-Inc.-datasheet-139480.pdf?src-supplier=Digi-Key; Max Repetitive Reverse Voltage (Vrrm): 75V; Max Reverse Voltage (DC): 75V; ComponentLink5Description: https://datasheet.ciiva.com/1179/ds30097-1179355.pdf?src-supplier=Element14; Package Quantity: 3000; Contact Plating: Tin; ComponentLink14Description: http://datasheet.octopart.com/1N4148WS-7-F-Diodes-Inc.-datasheet-34441419.pdf?src-supplier=Allied+Electronics; ComponentLink11URL: http://datasheet.octopart.com/1N4148WS-7-F-Diodes-Inc.-datasheet-11839050.pdf?src-supplier=Newark; ComponentLink7Description: https://datasheet.ciiva.com/911/ds30097-911741.pdf?src-supplier=Digi-Key; Voltage: 75V; DatasheetVersion: Rev. 25-2, 03/2016; ComponentLink17URL: http://datasheet.octopart.com/1N4148WS-7-F-Diodes-Inc.-datasheet-139480.pdf?src-supplier=Digi-Key; ComponentLink16Description: http://datasheet.octopart.com/1N4148WS-7-F-Diodes-Inc.-datasheet-479.pdf?src-supplier=Mouser; ComponentLink19URL: http://datasheet.octopart.com/1N4148WS-7-F-Diodes-Inc.-datasheet-14053694.pdf?src-supplier=IIIC; Reverse Recovery Time: 4ns; Peak Non-Repetitive Surge Current: 2A; Number of Pins: 2; ComponentLink15URL: http://datasheet.octopart.com/1N4148WS-7-F-Diodes-Inc.-datasheet-62305040.pdf?src-supplier=Element14; Average Rectified Current: 150mA; Weight: 0.000173oz; Max Surge Current: 2A; Max Operating Temperature: 150°C; Min Operating Temperature: -65°C; Output Current: 150mA; ComponentLink21Description: http://datasheet.octopart.com/1N4148WS-7-F-Pericom-datasheet-62305040.pdf?src-supplier=Newark; ComponentLink2URL: http://www.diodes.com/datasheets/ds30097.pdf; ComponentLink9URL: https://datasheet.ciiva.com/25946/ds30097-25946926.pdf?src-supplier=Avnet+Europe; ComponentLink14URL: http://datasheet.octopart.com/1N4148WS-7-F-Diodes-Inc.-datasheet-34441419.pdf?src-supplier=Allied+Electronics
LDR1 = NSL-5910: Ambient Light Sensors Hermetic Photocell
LED1 = CMP-036-0000-2: THT LED round mono-color waterclear, WL-TMRW , RED; PartNumber: 151034rs03000; Manufacturer: Wuerth Elektronik; Darkglass part: D00-0042; Available Preview Images: 2D; Selective Soldering: YES; ComponentLink2URL: http://katalog.we-online.de/pbs/datasheet/7448042001.pdfhttp://katalog.we-online.de/pbs/datasheet/7448042001.pdfhttp://katalog.we-online.de/pbs/datasheet/7448042001.pdfhttp://katalog.we-online.de/pbs/datasheet/151033BS03000.pdf; Fitted: Fitted; Emitting color: RED; ComponentLink1URL: http://www.we-online.com; Design Item ID: LED 3mm RED; Supplied by Darkglass: YES; Source: main.SchLib; ComponentLink1Description: Manufacturer URL; Mouser part: 710-151034RS03000; PackageReference: Type 3mm; ComponentLink2Description: Datasheet; Darkglass: D00-0042
R7 R9 R10 R12 R13 = CMP-02701-2: as R4 on sheet Pre-amp; Composition: Thin film; Size (Imperial): 0805
R11 = CMP-02638-2: Resistor 30k +-1% 0805 Thin film 0.125W +-50ppm/°C; Maximum working voltage: 150V; Temperature Coefficient (ppm/°C): 50; Composition: Thin film; Size (Imperial): 0805
R15 = CMP-02452-2: Resistor 680R +-1% 0805 Thin film 0.125W +-50ppm/°C; Temperature Coefficient (ppm/°C): 50; Maximum working voltage: 150V; Size (Imperial): 0805; Composition: Thin film
R37 = CMP-02586-2: Resistor 10k +-1% 0805 Thin film 0.125W +-50ppm/°C; Maximum working voltage: 150V; Temperature Coefficient (ppm/°C): 50; Size (Imperial): 0805; Composition: Thin film
U1 U3 U4 = CMP-028-0012-7: as U1 on sheet Pre-amp; ComponentLink4URL: http://www.farnell.com/datasheets/1862384.pdf?src-supplier=Element14; ComponentLink4Description: http://www.farnell.com/datasheets/1862384.pdf?src-supplier=Element14; Manufacturer Part Number 1: TL072CD; REACH SVHC: No SVHC; Pricing 1: 1 = 0.71000, 10 = 0.59500, 50 = 0.59500, 100 = 0.38400, 1000 = 0.30700, 10000 = 0.25000 (USD); RoHS: Yes; Source: main.SchLib; ComponentLink1URL: http://www.ti.com/general/docs/lit/getliterature.tsp?genericPartNumber=TL072&&fileType=pdf&src-supplier=Avnet; Height: 1.58mm; Gain Bandwidth Product: 3MHz; ComponentLink5URL: http://focus.ti.com/lit/ds/symlink/tl074.pdf?src-supplier=Avnet+Asia; Number of Amplifiers: 2; ComponentLink2Description: https://www.distrelec.biz/Web/Downloads/_t/ds/tl07x-series_eng_tds.pdf?mime=application%2Fpdf&src-supplier=Distrelec; Radiation Hardening: No; ComponentLink3URL: http://www.ti.com/lit/ds/symlink/tl071a.pdf?src-supplier=Digi-Key; Unity Gain Bandwidth Product: 3MHz; Case/Package: D; Max Operating Temperature: 85°C; Packaging: Rail/Tube; Number of Circuits: 2; Number of Pins: 8; Length: 4.9mm; Number of Channels: 2; Package Quantity: 75; Min Operating Temperature: -40°C; Width: 3.91mm; Lead Free: Lead Free; Stock 1: 14514; ComponentLink3Description: http://www.ti.com/lit/ds/symlink/tl071a.pdf?src-supplier=Digi-Key; Nominal Gain Bandwidth Product: 3MHz; ComponentLink5Description: http://focus.ti.com/lit/ds/symlink/tl074.pdf?src-supplier=Avnet+Asia; Max Dual Supply Voltage: 18V; ComponentLink1Description: http://www.ti.com/general/docs/lit/getliterature.tsp?genericPartNumber=TL072&&fileType=pdf&src-supplier=Avnet; ComponentLink2URL: https://www.distrelec.biz/Web/Downloads/_t/ds/tl07x-series_eng_tds.pdf?mime=application%2Fpdf&src-supplier=Distrelec; Design Item ID: TL072CD
VR2 = CMP-028-0051-3: LJV 9mm pot; Darkglass part: D00-0000; Manufacturer Part Number: RP09110NOBA-H02-1484 (A104,KA15A6.5); Value: 100kA; Selective Soldering: YES; SET POSITION: 1; Design Item ID: Pot100kA 9mm; Source: main.SchLib; Supplied by Darkglass: YES; PartId: 1

## Sheet Out.SchDoc
size A4; SheetNumber: 4; SheetTotal: 7
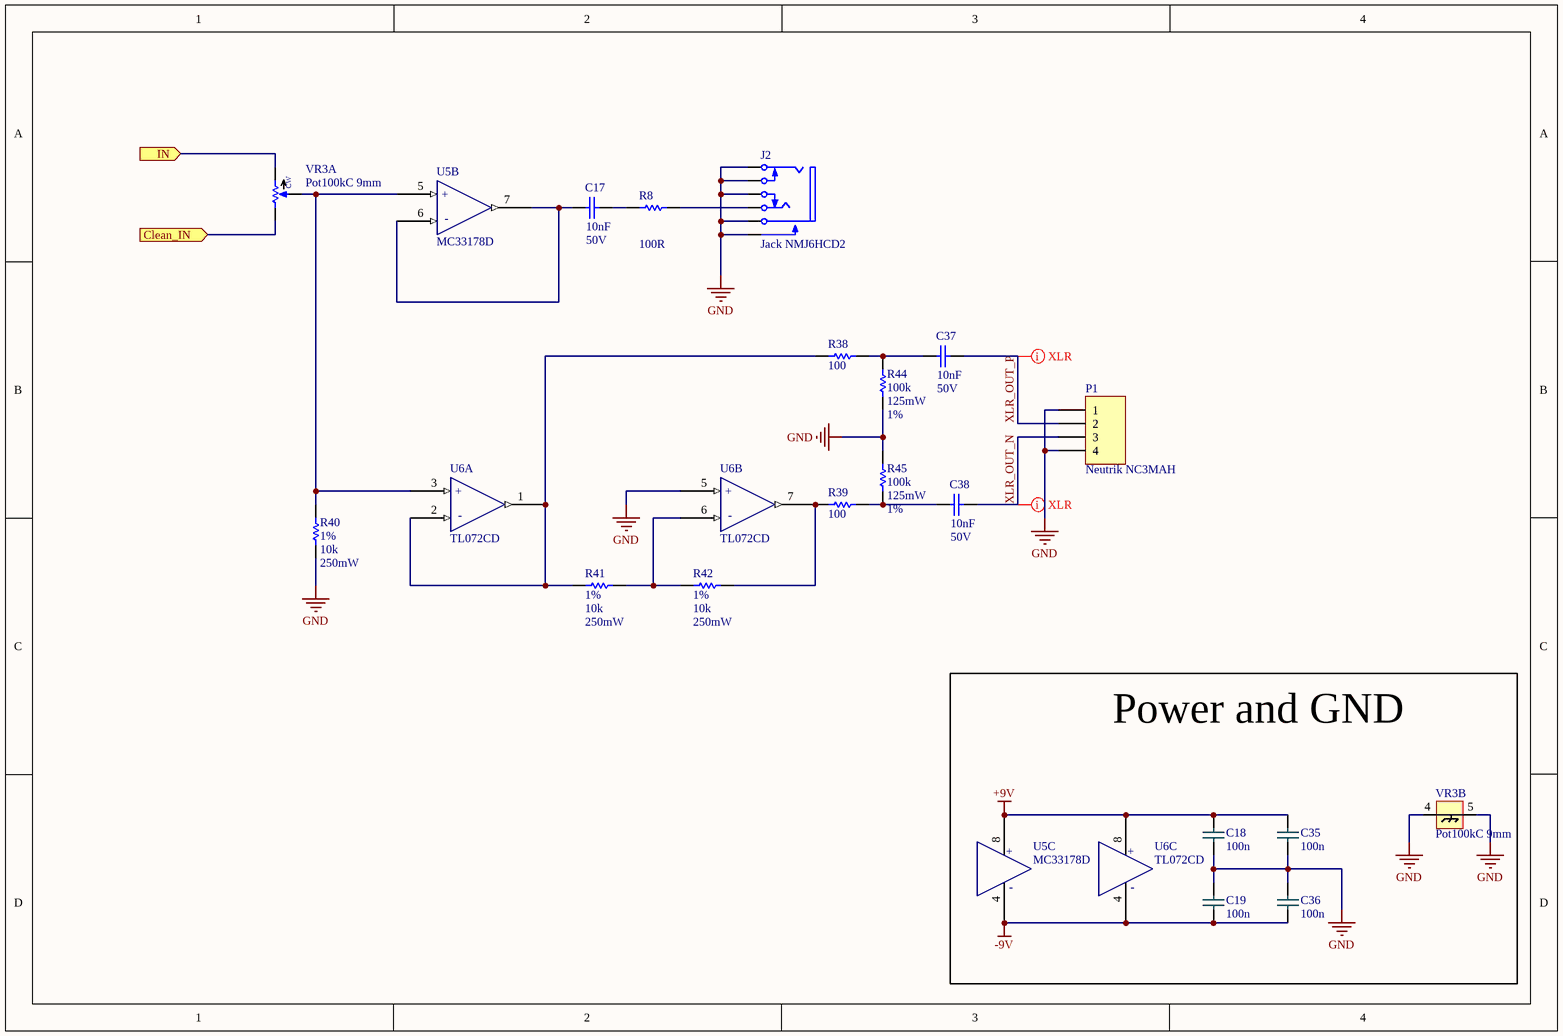
[diagram p3: Out.SchDoc]

### Parts
C17  Capacitance: 10nF  Rated Voltage: 50V  [0805-CAP]  (hidden comment: Cap 10nF 0805 C0G)
C18  value 100n  [0805-CAP]  (hidden comment: Cap 0805 100nF 4)
C19  value 100n  [0805-CAP]  (hidden comment: Cap 0805 100nF 4)
C35  value 100n  [0805-CAP]  (hidden comment: Cap 0805 100nF 4)
C36  value 100n  [0805-CAP]  (hidden comment: Cap 0805 100nF 4)
C37  Capacitance: 10nF  Rated Voltage: 50V  [0805-CAP]  (hidden comment: Cap 10nF 0805 C0G)
C38  Capacitance: 10nF  Rated Voltage: 50V  [0805-CAP]  (hidden comment: Cap 10nF 0805 C0G)
J2  Jack NMJ6HCD2  [Neutrik Jack metal nut]
P1  Neutrik NC3MAH  [NC3MAH-0 XLR]
R8  Resistance: 100R  [0805-RES]  (hidden comment: Res 0805 100R 1%)
R38  Resistance: 100  [1206-RES]  (hidden comment: Res 100R 1% 1206)
R39  Resistance: 100  [1206-RES]  (hidden comment: Res 100R 1% 1206)
R40  Tolerance (+-): 1%  Resistance: 10k  Power: 250mW  [1206-RES]  (hidden comment: Res 10k 1% 1206)
R41  Tolerance (+-): 1%  Resistance: 10k  Power: 250mW  [1206-RES]  (hidden comment: Res 10k 1% 1206)
R42  Tolerance (+-): 1%  Resistance: 10k  Power: 250mW  [1206-RES]  (hidden comment: Res 10k 1% 1206)
R44  Resistance: 100k  Power: 125mW  Tolerance (+-): 1%  [0805-RES]  (hidden comment: Res 100k 1% 0805)
R45  Resistance: 100k  Power: 125mW  Tolerance (+-): 1%  [0805-RES]  (hidden comment: Res 100k 1% 0805)
U5  MC33178D  [SOIC8-127P600X175-8N]  (parts B,C of 3)
U6  TL072CD  [SOIC8-127P600X175-8N]  (parts A,B,C of 3)
VR3  Pot100kC 9mm  [LJV 9mm pot]  (parts A,B of 2)

### Blocks framed on the sheet
Power and GND: C18 C19 C35 C36 U5 U6 VR3

### Ports
Clean_IN (in), IN (in)

### Nets
+9V: C18.2 C35.2 U5.8 U6.8(V+)
-9V: C19.1 C36.1 U5.4 U6.4(V-)
GND: C18.1 C19.2 C35.1 C36.2 J2.1 J2.2 J2.4 J2.5 J2.6 P1.1 P1.4 R40.1 R44.1 R45.2 U6.5(IN+) VR3.4 VR3.5
XLR_OUT_N: C38.2 P1.3
XLR_OUT_P: C37.2 P1.2
NetC17_1: C17.1 U5.6 U5.7
NetC17_2: C17.2 R8.2
NetC37_1: C37.1 R38.1 R44.2
NetC38_1: C38.1 R39.1 R45.1
NetJ2_3: J2.3 R8.1
NetR24_2: VR3.3(CWPIN) ; port IN
NetR38_2: R38.2 R41.1 U6.1(OUT) U6.2(IN-)
NetR39_2: R39.2 R42.2 U6.7
NetR40_2: R40.2 U5.5 U6.3(IN+) VR3.2(WIPER)
NetR41_2: R41.2 R42.1 U6.6(IN-)
NetS2_1: VR3.1(CCWPIN) ; port Clean_IN

### Layout directives
differential pair: XLR_OUT_N, XLR_OUT_P

### Notes on the sheet
- (in symbol CMP-028-0012-7, part A) +; -
- (in symbol CMP-028-0012-7, part B) +; -
- (in symbol CMP-028-0012-7, part C) +; -
- (in symbol CMP-028-0053-5, part A) CW
- (in symbol CMP-032-0003-7, part B) +; -
- (in symbol CMP-032-0003-7, part C) +; -

### Library data of the parts
C17 C37 C38 = CMP-04096-2: as C2 on sheet Pre-amp; Dielectric: C0G; Maximum operating temperature: 125°C; Height: 950µm; Size (Imperial): 0805
C18 C19 C35 C36 = CMP-019-0144-11: 0.1uF 25volts C0G 5%; Source: main.SchLib; PackageDescription: Chip Capacitor; LatestRevisionNote: IPC-7351 Footprint Added.; LatestRevisionDate: 29-May-2009; Publisher: Altium Limited; Published: 8-Jun-2000; Mouser part: 81-GRM31C5C1E104JA01; Design Item ID: Cap 0805 100nF 4; PackageReference: C1206; Fitted: Fitted
J2 = CMP-028-0060-3: as J1 on sheet Pre-amp; Orientation: Straight; Depth: 18.2mm; ComponentLink3Description: http://datasheet.octopart.com/NMJ6HCD2-Neutrik-datasheet-66533984.pdf?src-supplier=Newark; Package Quantity: 200; ComponentLink1Description: https://datasheet.ciiva.com/16148/210-217181-16148163.pdf?src-supplier=Onlinecomponents.com; Color: Black; Max Operating Temperature: 70°C; Termination: Solder; Design Item ID: Jack NMJ6HCD2; Source: main.SchLib; Mount: Through Hole; Contact Material: Chrome; Number of Terminals: 6; ComponentLink1URL: https://datasheet.ciiva.com/16148/210-217181-16148163.pdf?src-supplier=Onlinecomponents.com; Manufacturer Part Number: NMJ6HCD2; Pricing 1: 1 = 1.74000, 10 = 1.57000, 50 = 1.37000, 100 = 1.32000, 1000 = 1.24000, 10000 = 1.24000 (USD); Weight: 0.282192oz; Selective Soldering: YES; Stock 1: 16927; ComponentLink3URL: http://datasheet.octopart.com/NMJ6HCD2-Neutrik-datasheet-66533984.pdf?src-supplier=Newark; ComponentLink2Description: http://datasheet.octopart.com/NMJ6HCD2-Neutrik-datasheet-46041.pdf?src-supplier=Allied+Electronics; Housing Material: Polyamide; Contact Plating: Silver; Min Operating Temperature: -25°C; ComponentLink2URL: http://datasheet.octopart.com/NMJ6HCD2-Neutrik-datasheet-46041.pdf?src-supplier=Allied+Electronics
P1 = CMP-028-0069-6: Neutrik XLR NC3MAH; Darkglass part: D00-0015; Selective Soldering: Yes; Ratings: IP40; Voltage Rating (DC): 50V; Body Material: Plastic; Current Rating: 6A; Number of Ports: 1; Number of Positions: 3; Approvals: UL; Gender: Male; Contact Plating: Gold; ComponentLink6Description: https://datasheet.ciiva.com/16147/nc3mah-16147837.pdf?src-supplier=Onlinecomponents.com; RoHS: Yes; ComponentLink5URL: https://datasheet.ciiva.com/8007/312284-8007895.pdf?src-supplier=Element14; Number of Terminals: 3; Design Item ID: Neutrik NC3MAH; Stock 1: 3272; Source: main.SchLib; ComponentLink2Description: https://datasheet.ciiva.com/14118/hpnc3mah-14118008.pdf?src-supplier=Distrelec; Length: 25.35mm; ComponentLink1Description: https://datasheet.ciiva.com/23762/312284-23762209.pdf?src-supplier=Newark; ComponentLink6URL: https://datasheet.ciiva.com/16147/nc3mah-16147837.pdf?src-supplier=Onlinecomponents.com; ComponentLink1URL: https://datasheet.ciiva.com/23762/312284-23762209.pdf?src-supplier=Newark; Manufacturer Part Number: NC3MAH; Max Operating Temperature: 80°C; Depth: 22.2mm; Manufacturer: Neutrik; Voltage Rating: 50V; ComponentLink4Description: https://datasheet.ciiva.com/26947/getdatasheetpartid-563979-26947627.pdf?src-supplier=Verical; Weight: 0.246918oz; ComponentLink2URL: https://datasheet.ciiva.com/14118/hpnc3mah-14118008.pdf?src-supplier=Distrelec; ComponentLink4URL: https://datasheet.ciiva.com/26947/getdatasheetpartid-563979-26947627.pdf?src-supplier=Verical; Min Operating Temperature: -30°C; Orientation: Right Angle; Mount: Panel; Contact Material: Brass; Color: Black; Supplied by Darkglass: Yes; Package Quantity: 10; Contact Gender: Male; Pricing 1: 1 = 0,85000, 10 = 0,70700, 50 = 0,70700, 100 = 0,45600, 1000 = 0,36500, 10000 = 0,29600 (USD); Housing Material: Polyamide; ComponentLink3URL: https://datasheet.ciiva.com/11720/0900766b80f3b31a-11720874.pdf?src-supplier=RSComponents; Material: Plastic; REACH SVHC: No SVHC; Termination: Solder; Max Current Rating: 6A; Flammability Rating: UL94 V-0; Number of Contacts: 3; ComponentLink3Description: https://datasheet.ciiva.com/11720/0900766b80f3b31a-11720874.pdf?src-supplier=RSComponents; ComponentLink5Description: https://datasheet.ciiva.com/8007/312284-8007895.pdf?src-supplier=Element14
R8 = CMP-037-0118-8: 100ohm, 125mW, 1%, thin film; Temperature Coefficient: 50ppm/°C; Voltage Rating (DC): 150V; Composition: Thin Film; Case/Package: 0805; Case Code (Imperial): 0805; Case Code (Metric): 2012; ComponentLink1Description: https://datasheet.ciiva.com/2560/pyu-rt-1-to-0-05-rohs-l-5-2560883.pdf?src-supplier=Digi-Key; ComponentLink1URL: https://datasheet.ciiva.com/2560/pyu-rt-1-to-0-05-rohs-l-5-2560883.pdf?src-supplier=Digi-Key; ComponentLink2Description: https://datasheet.ciiva.com/5624/pyu-rt-1-to-0-05-rohs-l-4-5624374.pdf?src-supplier=Mouser; ComponentLink2URL: https://datasheet.ciiva.com/5624/pyu-rt-1-to-0-05-rohs-l-4-5624374.pdf?src-supplier=Mouser; ComponentLink3Description: https://datasheet.ciiva.com/7942/442970-7942070.pdf?src-supplier=Element14; ComponentLink3URL: https://datasheet.ciiva.com/7942/442970-7942070.pdf?src-supplier=Element14; ComponentLink4Description: https://datasheet.ciiva.com/5925/442970-5925320.pdf?src-supplier=Farnell; ComponentLink4URL: https://datasheet.ciiva.com/5925/442970-5925320.pdf?src-supplier=Farnell; Contact Plating: Tin; Depth: 1.25mm; Design Item ID: Res 0805 100R 1%; Features: Moisture Resistant; Height: 0.024inch; LatestRevisionDate: 17-Jul-2002; LatestRevisionNote: Re-released for DXP Platform.; Lead Free: Lead Free; Length: 2mm; Max Operating Temperature: 125°C; Max Power Dissipation: 125mW; Military Standard: Not; Min Operating Temperature: -55°C; Number of Pins: 2; Number of Terminations: 2; PackageDescription: Axial Device, Thru-Hole; 2 Leads; 0.5 in Pin Spacing; Package Quantity: 5000; PackageReference: AXIAL-0.5; Packaging: Tape and Reel; Power Rating: 125mW; Pricing 1: 1 = 0,10000, 10 = 0,09300, 100 = 0,03580, 1000 = 0,01573, 2500 = 0,01358 (USD); Published: 8-Jun-2000; Publisher: Altium Limited; Radiation Hardening: No; REACH SVHC: No SVHC; RoHS: Yes; Source: main.SchLib; Stock 1: 52567; Termination: SMD/SMT; Tolerance: 1%; Value: 100R; Voltage Rating: 150V; Weight: 0.000194oz; Width: 0.049inch
R38 R39 = CMP-03662-2: Resistor 100R +-1% 1206 Thin film 0.25W +-50ppm/°C; Maximum working voltage: 200V; Temperature Coefficient (ppm/°C): 50; Power: 250mW; Size (Imperial): 1206; Tolerance (+-): 1%; Composition: Thin film
R40-R42 = CMP-03860-2: Resistor 10k +-1% 1206 Thin film 0.25W +-50ppm/°C; Maximum working voltage: 200V; Temperature Coefficient (ppm/°C): 50; Size (Imperial): 1206; Composition: Thin film
R44 R45 = CMP-02701-2: as R4 on sheet Pre-amp; Composition: Thin film; Size (Imperial): 0805
U5 = CMP-032-0003-7: as U2 on sheet Pre-amp; ComponentLink3Description: https://datasheet.ciiva.com/1796/mc33178-d-1796436.pdf?src-supplier=Digi-Key; Contact Plating: Tin; Packaging: Tape and Reel; ComponentLink4URL: https://datasheet.ciiva.com/8078/89824-8078566.pdf?src-supplier=Element14; ComponentLink1Description: https://datasheet.ciiva.com/30481/0900766b811a6563-30481352.pdf?src-supplier=RSComponents; Number of Pins: 8; Width: 0.157inch; ComponentLink6URL: https://datasheet.ciiva.com/2973/mc33178-d-2973665.pdf?src-supplier=Avnet; Nominal Gain Bandwidth Product: 5MHz; Min Operating Temperature: -40°C; Design Item ID: MC33178D; Lead Free: Lead Free; Max Dual Supply Voltage: 18V; ComponentLink9Description: https://datasheet.ciiva.com/26056/mc33178-d-26056808.pdf?src-supplier=Avnet+Europe; ComponentLink8URL: https://datasheet.ciiva.com/17068/70275428-17068423.pdf?src-supplier=Allied+Electronics; Length: 0.196inch; Gain Bandwidth Product: 5MHz; ComponentLink9URL: https://datasheet.ciiva.com/26056/mc33178-d-26056808.pdf?src-supplier=Avnet+Europe; Stock 1: 25846; Number of Channels: 2; Number of Amplifiers: 2; ComponentLink6Description: https://datasheet.ciiva.com/2973/mc33178-d-2973665.pdf?src-supplier=Avnet; ComponentLink5URL: https://datasheet.ciiva.com/48491/mc33178-d-48491755.pdf?src-supplier=Avnet; Mouser part: 863-MC33178DG; Case/Package: SOIC; Height: 0.059inch; ComponentLink5Description: https://datasheet.ciiva.com/48491/mc33178-d-48491755.pdf?src-supplier=Avnet; ComponentLink2URL: https://datasheet.ciiva.com/1796/mc33178-d-1796435.pdf?src-supplier=Digi-Key; Radiation Hardening: No; ComponentLink2Description: https://datasheet.ciiva.com/1796/mc33178-d-1796435.pdf?src-supplier=Digi-Key; ComponentLink8Description: https://datasheet.ciiva.com/17068/70275428-17068423.pdf?src-supplier=Allied+Electronics; Package Quantity: 1; ComponentLink1URL: https://datasheet.ciiva.com/30481/0900766b811a6563-30481352.pdf?src-supplier=RSComponents; Halogen Free: Halogen Free; Unity Gain Bandwidth Product: 5MHz; ComponentLink3URL: https://datasheet.ciiva.com/1796/mc33178-d-1796436.pdf?src-supplier=Digi-Key; ComponentLink4Description: https://datasheet.ciiva.com/8078/89824-8078566.pdf?src-supplier=Element14; Max Operating Temperature: 85°C; REACH SVHC: No SVHC; ComponentLink7Description: https://datasheet.ciiva.com/1796/mc33178-d-1796437.pdf?src-supplier=Digi-Key; Pricing 1: 1 = 0.86000, 10 = 0.75300, 100 = 0.57700, 500 = 0.45614, 1000 = 0.36492 (USD); ComponentLink7URL: https://datasheet.ciiva.com/1796/mc33178-d-1796437.pdf?src-supplier=Digi-Key; RoHS: Yes; Source: main.SchLib; Bandwidth: 5MHz; Number of Circuits: 2; Power Supply Rejection Ratio (PSRR): 80dB; PartId: 1
U6 = CMP-028-0012-7: as U1 on sheet Pre-amp; ComponentLink4URL: http://www.farnell.com/datasheets/1862384.pdf?src-supplier=Element14; ComponentLink4Description: http://www.farnell.com/datasheets/1862384.pdf?src-supplier=Element14; Manufacturer Part Number 1: TL072CD; REACH SVHC: No SVHC; Pricing 1: 1 = 0.71000, 10 = 0.59500, 50 = 0.59500, 100 = 0.38400, 1000 = 0.30700, 10000 = 0.25000 (USD); RoHS: Yes; Source: main.SchLib; ComponentLink1URL: http://www.ti.com/general/docs/lit/getliterature.tsp?genericPartNumber=TL072&&fileType=pdf&src-supplier=Avnet; Height: 1.58mm; Gain Bandwidth Product: 3MHz; ComponentLink5URL: http://focus.ti.com/lit/ds/symlink/tl074.pdf?src-supplier=Avnet+Asia; Number of Amplifiers: 2; ComponentLink2Description: https://www.distrelec.biz/Web/Downloads/_t/ds/tl07x-series_eng_tds.pdf?mime=application%2Fpdf&src-supplier=Distrelec; Radiation Hardening: No; ComponentLink3URL: http://www.ti.com/lit/ds/symlink/tl071a.pdf?src-supplier=Digi-Key; Unity Gain Bandwidth Product: 3MHz; Case/Package: D; Max Operating Temperature: 85°C; Packaging: Rail/Tube; Number of Circuits: 2; Number of Pins: 8; Length: 4.9mm; Number of Channels: 2; Package Quantity: 75; Min Operating Temperature: -40°C; Width: 3.91mm; Lead Free: Lead Free; Stock 1: 14514; ComponentLink3Description: http://www.ti.com/lit/ds/symlink/tl071a.pdf?src-supplier=Digi-Key; Nominal Gain Bandwidth Product: 3MHz; ComponentLink5Description: http://focus.ti.com/lit/ds/symlink/tl074.pdf?src-supplier=Avnet+Asia; Max Dual Supply Voltage: 18V; ComponentLink1Description: http://www.ti.com/general/docs/lit/getliterature.tsp?genericPartNumber=TL072&&fileType=pdf&src-supplier=Avnet; ComponentLink2URL: https://www.distrelec.biz/Web/Downloads/_t/ds/tl07x-series_eng_tds.pdf?mime=application%2Fpdf&src-supplier=Distrelec; Design Item ID: TL072CD
VR3 = CMP-028-0053-5: as VR1 on sheet Pre-amp; Source: main.SchLib; Design Item ID: Pot100kC 9mm; Supplied by Darkglass: YES